# EAGLE board Proiect (EAGLE 9.7.0)
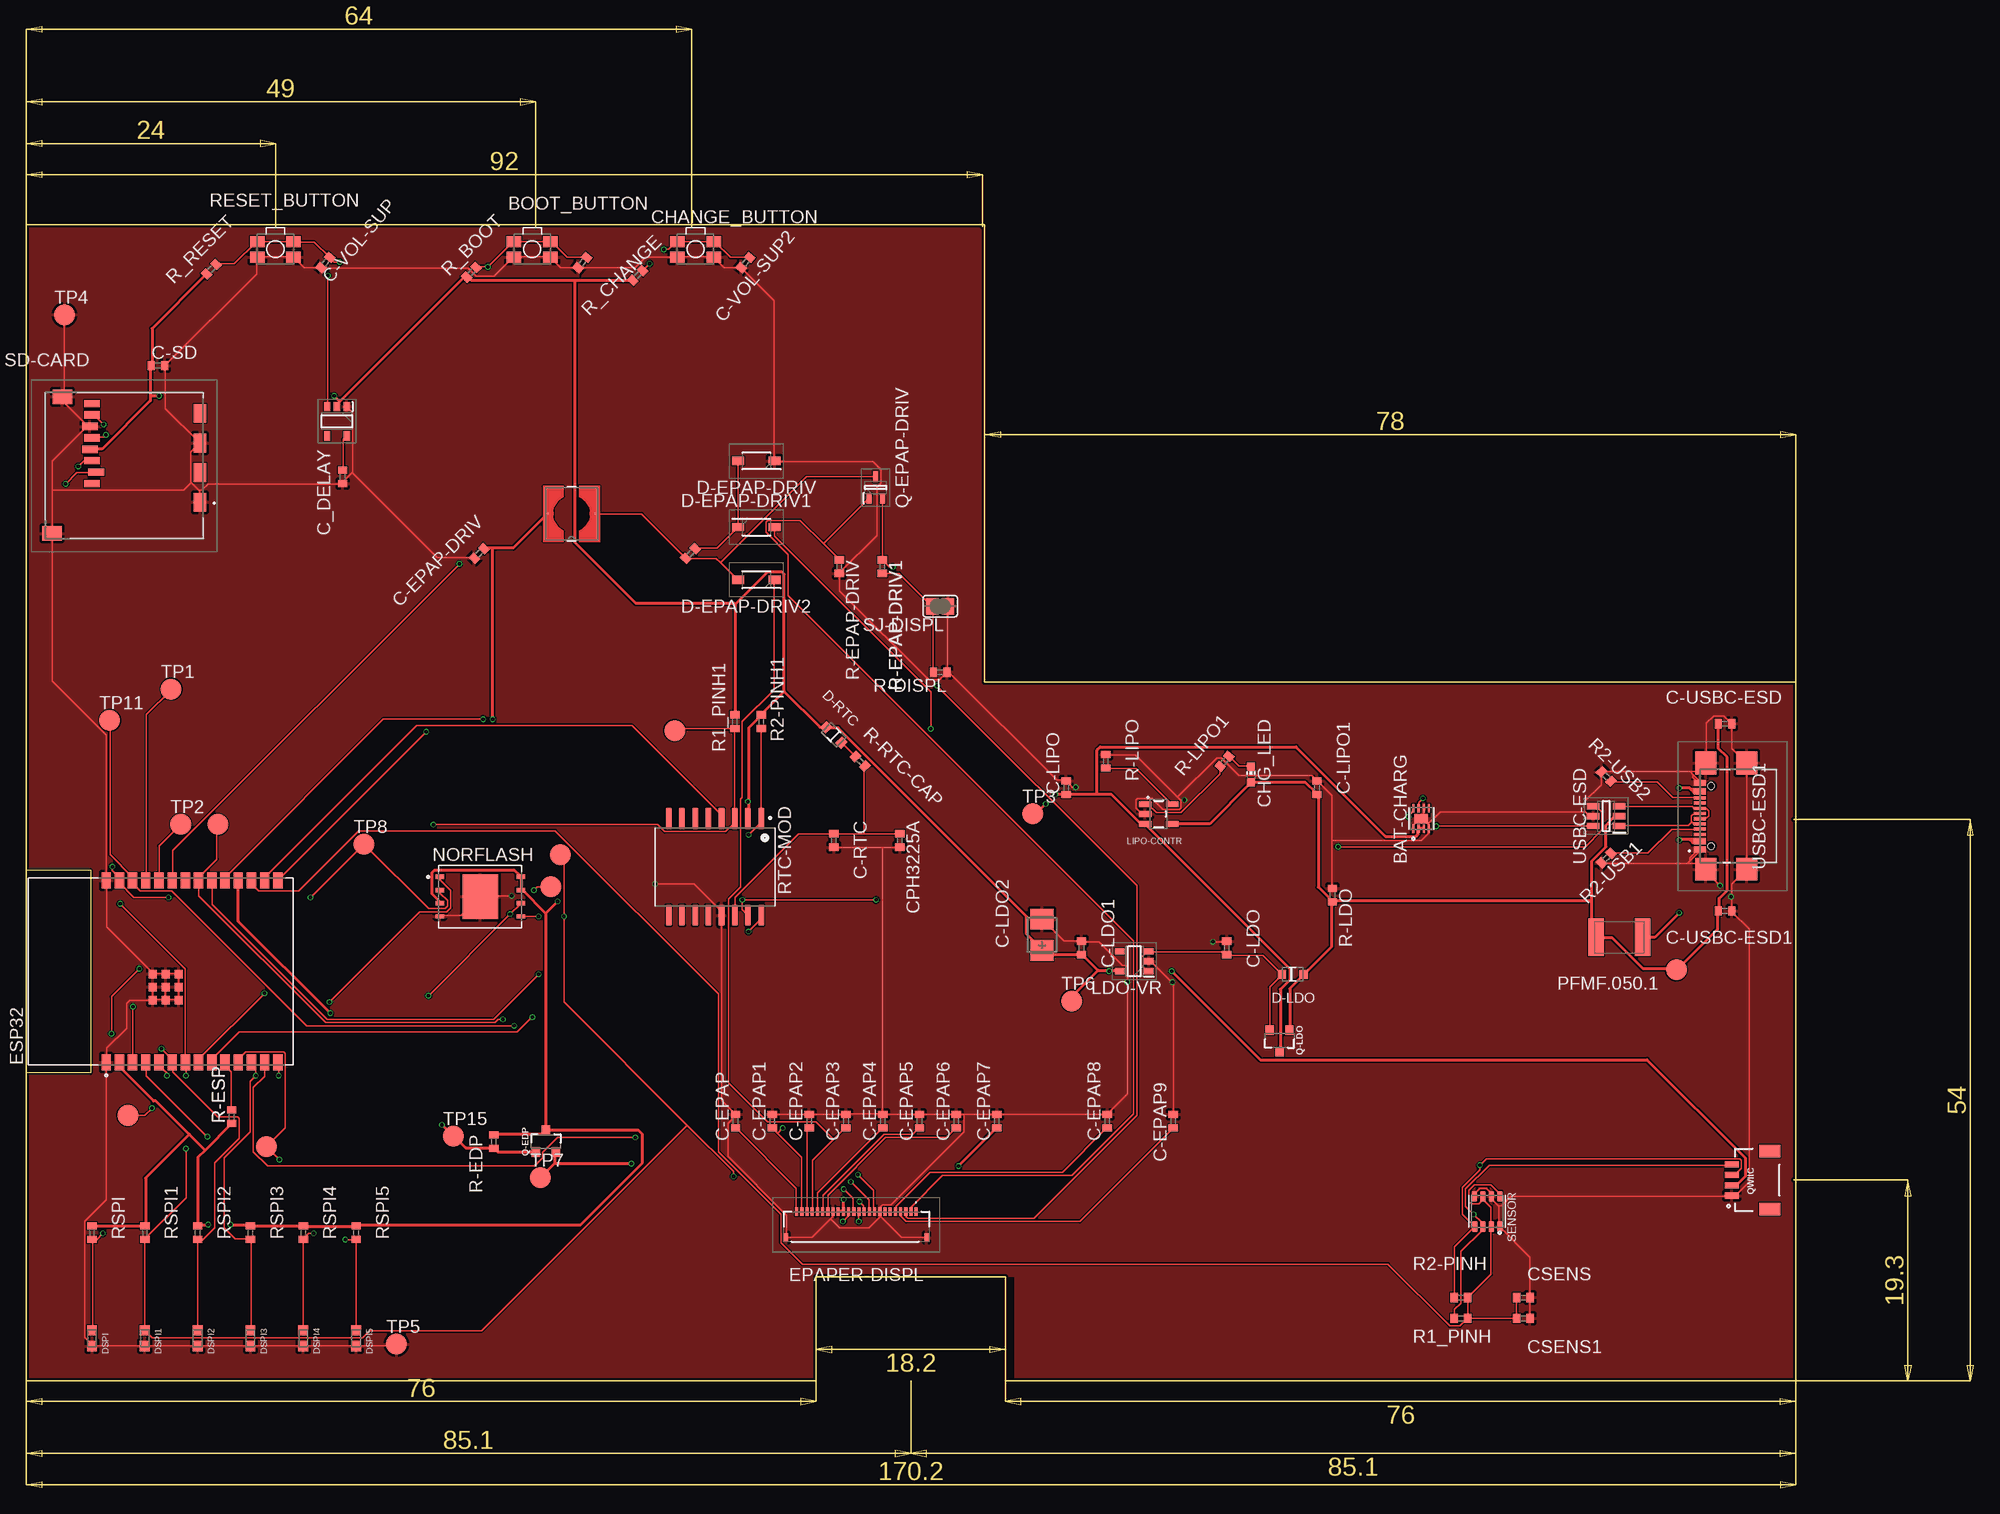
[diagram p1: board, top side]
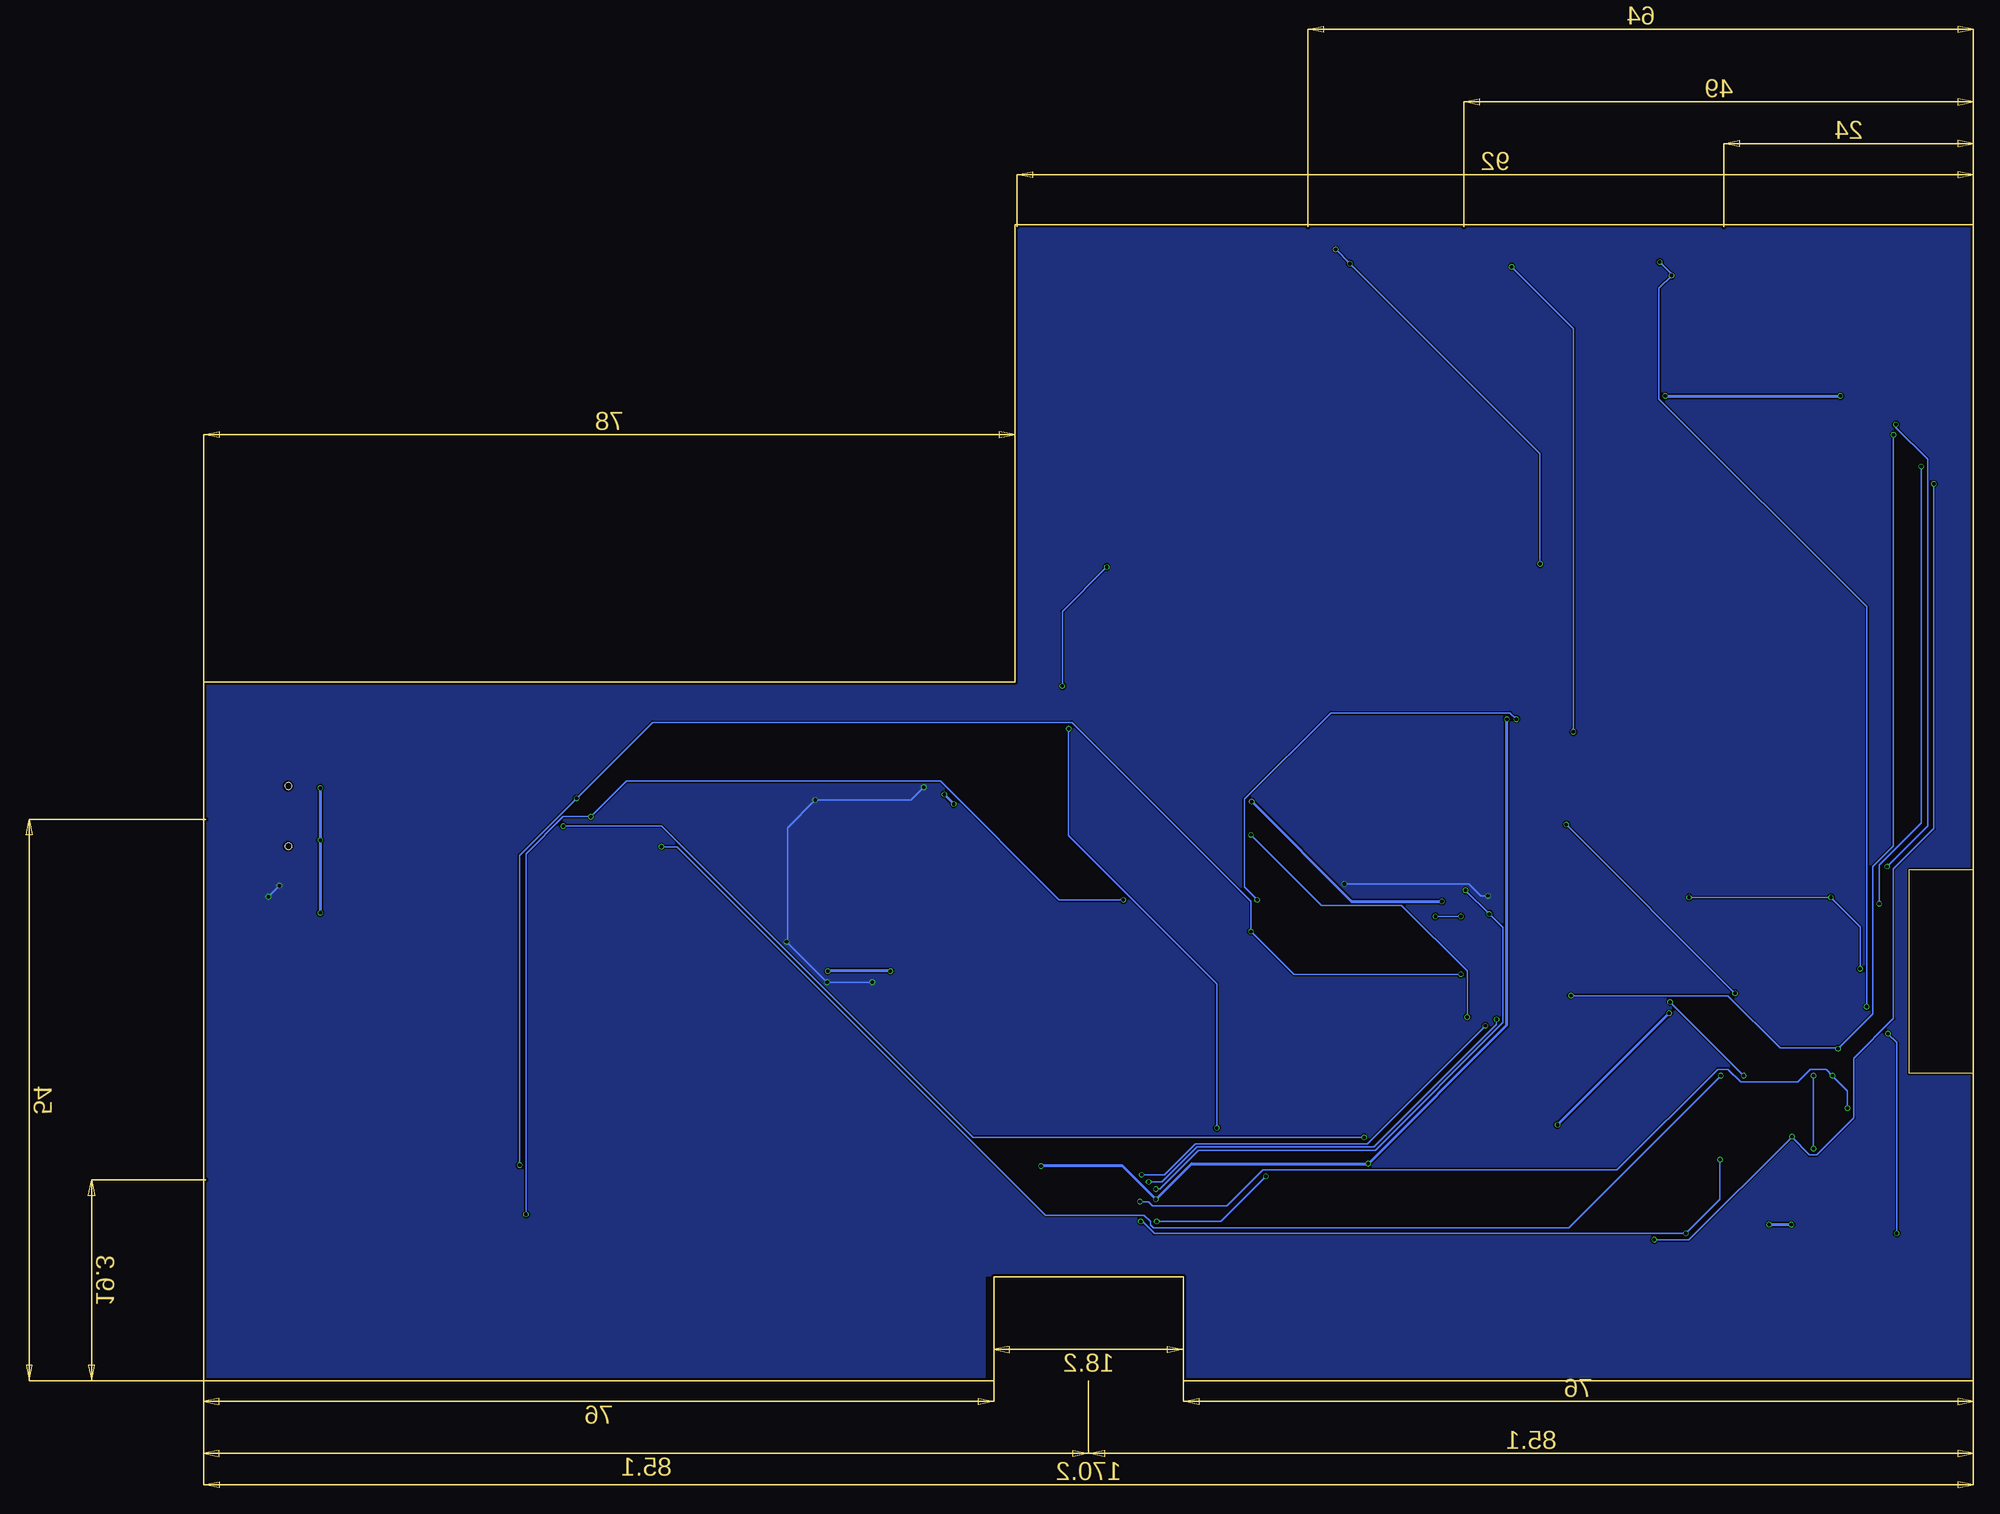
[diagram p2: board, bottom side, seen from below]

Size 170.2 x 111.2 mm. Coordinates in mm from the lower left corner, seen from the top.
Outline: 0,0 76,0 76,10 94.2,10 94.2,0 170.2,0 170.2,67.2 92.2,67.2 92.2,111.2 0,111.2 0,49.12 6.22,49.12 6.22,49.11 6.22,29.59 0,29.59 0,0
Copper layers (1*16): Top 0.035mm / dielectric 1.6mm / Bottom 0.035mm
Design rules "jlcpcb-2layers": minimum track width 5mil, minimum drill 0.3mm, track to track 5mil, track to pad 5mil, pad to pad 5mil, via to via 5mil, smd to smd 5mil, copper to edge 0.2mm, drill to drill 6mil, minimum pad ring 10mil, minimum via ring 3mil, stop-mask expansion 4mil, vias tented up to drill 0mil, thermal gap 10mil
Net classes: 2 POWER: width 0.3 mm

## Footprints (pad centres in the part's own frame; a part is rotated, then mirrored left to right if it is on the bottom)
SON50P200X200X80-9N = smd 0.76 x 0.27: 1 -0.985,0.75; 2 -0.985,0.25; 3 -0.985,-0.25; 4 -0.985,-0.75; 5 0.985,-0.75; 6 0.985,-0.25; 7 0.985,0.25; 8 0.985,0.75 | smd 0.9 x 1.3: 9 0,0
MYBUTTON = smd 1.4 x 1.05: 1 1.75,0.75; 2 -1.75,0.75; 3 -1.75,-0.75; 4 1.75,-0.75
ESP32_WROVER_EAGLE-LTSPICE_C0402 = smd 0.7 x 0.9: 1 -0.65,0; 2 0.65,0
RCL_CT3528 = smd 2 x 2.2: + -1.5,0; - 1.5,0
ADAFRUIT_CHIP-LED0603 = smd 0.8 x 0.8: A 0,-0.75; C 0,0.75
SOD3716X135N = smd 1.15 x 0.8: 1 -1.75,0; 2 1.75,0
ESP32_WROVER_AVX---SD0805S020S1R0_AVX_SD0805S020S1R0_0 = smd 0.8 x 0.9: 1 -1.05,0; 2 1.05,0
DIOC1608X36N = smd 0.97 x 0.94: 1 -0.75,0; 2 0.75,0
FH34SRJ24S05SH99 = smd 0.3 x 0.8: 1 5.75,1.45; 2 5.25,1.45; 3 4.75,1.45; 4 4.25,1.45; 5 3.75,1.45; 6 3.25,1.45; 7 2.75,1.45; 8 2.25,1.45; 9 1.75,1.45; 10 1.25,1.45; 11 0.75,1.45; 12 0.25,1.45; 13 -0.25,1.45; 14 -0.75,1.45; 15 -1.25,1.45; 16 -1.75,1.45; 17 -2.25,1.45; 18 -2.75,1.45; 19 -3.25,1.45; 20 -3.75,1.45; 21 -4.25,1.45; 22 -4.75,1.45; 23 -5.25,1.45; 24 -5.75,1.45 | smd 0.4 x 0.8: MP1 6.75,-1.05; MP2 -6.75,-1.05
XCVR_ESP32-C6-WROOM-1-N8 = smd 1.5 x 0.9: 1 -8.75,5.26; 2 -8.75,3.99; 3 -8.75,2.72; 4 -8.75,1.45; 5 -8.75,0.18; 6 -8.75,-1.09; 7 -8.75,-2.36; 8 -8.75,-3.63; 9 -8.75,-4.9; 10 -8.75,-6.17; 11 -8.75,-7.44; 12 -8.75,-8.71; 13 -8.75,-9.98; 14 -8.75,-11.25; 15 8.75,-11.25; 16 8.75,-9.98; 17 8.75,-8.71; 18 8.75,-7.44; 19 8.75,-6.17; 20 8.75,-4.9; 21 8.75,-3.63; 22 8.75,-2.36; 23 8.75,-1.09; 24 8.75,0.18; 25 8.75,1.45; 26 8.75,2.72; 27 8.75,3.99; 28 8.75,5.26 | smd 0.8 x 0.8: 29_1 -2.755,0.79; 29_2 -1.505,0.79; 29_3 -0.255,0.79; 29_4 -2.755,-0.46; 29_5 -1.505,-0.46; 29_6 -0.255,-0.46; 29_7 -2.755,-1.71; 29_8 -1.505,-1.71; 29_9 -0.255,-1.71
IND_4828-WE-TPC_WRE = smd 0.127 x 0.127: 1 -2.286,0; 2 2.286,0
SOT95P280X120-5N = smd 0.9 x 0.6: 1 -1.4,0.95; 2 -1.4,0; 3 -1.4,-0.95; 4 1.4,-0.95; 5 1.4,0.95
ESP32_WROVER_SPARKFUN-IC-POWER_SOT23-5 = smd 0.55 x 1.2: 1 -0.95,-1.3; 2 0,-1.3; 3 0.95,-1.3; 4 0.95,1.3; 5 -0.95,1.3
SON127P600X800X80-9N = smd 0.94 x 0.44: 1 -3.895,1.905; 2 -3.895,0.635; 3 -3.895,-0.635; 4 -3.895,-1.905; 5 3.895,-1.905; 6 3.895,-0.635; 7 3.895,0.635; 8 3.895,1.905 | smd 3.4 x 4.3: 9 0,0
ESP32C6_VARISTOR_CT/CN1812 = smd 1.5 x 3.6: 1 -2.25,0; 2 2.25,0
ESP32_WROVER_SPARKFUN-DISCRETESEMI_SOT23-3 = smd 0.8 x 0.9: 1 -0.95,-1; 2 0.95,-1; 3 0,1.1
SOT65P210X110-3N = smd 1.05 x 0.5: 1 -1.05,0.65; 2 -1.05,-0.65; 3 1.05,0
JST04_1MM_RA = smd 0.6 x 1.35: 1 -1.5,0; 2 -0.5,0; 3 0.5,0; 4 1.5,0 | smd 1.2 x 2: NC1 2.8,-3.675; NC2 -2.8,-3.675
ESP32_WROVER_EAGLE-LTSPICE_R0402 = smd 0.7 x 0.9: 1 -0.65,0; 2 0.65,0
SOIC127P1032X265-16N = smd 2.05 x 0.59: 1 -4.655,4.445; 2 -4.655,3.175; 3 -4.655,1.905; 4 -4.655,0.635; 5 -4.655,-0.635; 6 -4.655,-1.905; 7 -4.655,-3.175; 8 -4.655,-4.445; 9 4.655,-4.445; 10 4.655,-3.175; 11 4.655,-1.905; 12 4.655,-0.635; 13 4.655,0.635; 14 4.655,1.905; 15 4.655,3.175; 16 4.655,4.445
112ATAARR03ATTEND = smd 1.8 x 1.2: G1 10.6,10.4; G2 4.9,10.4; S1 7.75,10.4; S2 2.05,10.4 | smd 1.4 x 1.9: G3 13.6,-3.85; G4 0.45,-2.85 | smd 0.7 x 1.5: P1 8.8,0; P2 7.7,0.4; P3 6.6,0; P4 5.5,-0.2; P5 4.4,0; P6 3.3,-0.2; P7 2.2,0; P8 1.1,0
ESP32_WROVER_BME680_PSON80P300X300X100-8N = smd 1.016 x 0.5: 1 1.458,1.2; 2 1.458,0.4; 3 1.458,-0.4; 4 1.458,-1.2; 5 -1.458,-1.22; 6 -1.458,-0.4; 7 -1.458,0.4; 8 -1.458,1.2
SJ = smd 1.168 x 1.6: 1 -0.762,0; 2 0.762,0
TP20R = smd 2 x 2: TP 0,0
SOT95P280X145-6N = smd 1.2 x 0.6: 1 -1.25,0.95; 2 -1.25,0; 3 -1.25,-0.95; 4 1.25,-0.95; 5 1.25,0; 6 1.25,0.95
SAMACSYS_PARTS_USB4110GFA = smd 0.3 x 1.15: A1 -3.35,3.678; A4 -2.55,3.678; A5 -1.25,3.678; A6 -0.25,3.678; A7 0.25,3.678; A8 1.25,3.678; A9 2.55,3.678; A12 3.35,3.678; B1 3.05,3.678; B4 2.25,3.678; B5 1.75,3.678; B6 0.75,3.678; B7 -0.75,3.678; B8 -1.75,3.678; B9 -2.25,3.678; B12 -3.05,3.678 | smd 2.18 x 2: MP1 -5.11,-0.827; MP2 5.11,-0.827; MP3 -5.11,3.103; MP4 5.11,3.103 | hole 0.65: -2.89,2.603; 2.89,2.603
SOT95P280X125-5N = smd 0.9 x 0.6: 1 -1.4,0.95; 2 -1.4,0; 3 -1.4,-0.95; 4 1.4,-0.95; 5 1.4,0.95

## Placement (x,y rotation side)
BAT-CHARG  MAX17048G+T10  [SON50P200X200X80-9N]  134.19,54.07 90 top
BOOT_BUTTON  BOOT_BUTTON  [MYBUTTON]  48.69,108.82 180 top
C-EPAP  1uF/50V  [ESP32_WROVER_EAGLE-LTSPICE_C0402]  68.24,24.97 90 top
C-EPAP1  1uF/50V  [ESP32_WROVER_EAGLE-LTSPICE_C0402]  71.78,24.97 90 top
C-EPAP2  1uF/50V  [ESP32_WROVER_EAGLE-LTSPICE_C0402]  75.32,24.97 90 top
C-EPAP3  1uF/50V  [ESP32_WROVER_EAGLE-LTSPICE_C0402]  78.86,24.97 90 top
C-EPAP4  1uF/50V  [ESP32_WROVER_EAGLE-LTSPICE_C0402]  82.4,24.97 90 top
C-EPAP5  1uF/50V  [ESP32_WROVER_EAGLE-LTSPICE_C0402]  85.94,24.97 90 top
C-EPAP6  1uF/50V  [ESP32_WROVER_EAGLE-LTSPICE_C0402]  89.48,24.97 90 top
C-EPAP7  0.1uF/50V  [ESP32_WROVER_EAGLE-LTSPICE_C0402]  93.37,24.97 90 top
C-EPAP8  1uF/50V  [ESP32_WROVER_EAGLE-LTSPICE_C0402]  103.99,24.97 90 top
C-EPAP9  1uF/50V  [ESP32_WROVER_EAGLE-LTSPICE_C0402]  110.34,24.97 90 top
C-EPAP-DRIV  10uF  [ESP32_WROVER_EAGLE-LTSPICE_C0402]  43.58,79.57 225 top
C-EPAP-DRIV1  4.7uF/25V  [ESP32_WROVER_EAGLE-LTSPICE_C0402]  63.9,79.57 225 top
C-LDO  4.7uF  [ESP32_WROVER_EAGLE-LTSPICE_C0402]  115.48,41.62 90 top
C-LDO1  4.7uF  [ESP32_WROVER_EAGLE-LTSPICE_C0402]  101.51,41.62 90 top
C-LDO2  100uF  [RCL_CT3528]  97.7,42.89 90 top
C-LIPO  4.7uF  [ESP32_WROVER_EAGLE-LTSPICE_C0402]  100.03,57.04 90 top
C-LIPO1  4.7uF  [ESP32_WROVER_EAGLE-LTSPICE_C0402]  124.16,57.04 90 top
C-RTC  100nF  [ESP32_WROVER_EAGLE-LTSPICE_C0402]  77.69,51.96 270 top
C-SD  100nF  [ESP32_WROVER_EAGLE-LTSPICE_C0402]  12.7,97.63 0 top
C-USBC-ESD  100nF  [ESP32_WROVER_EAGLE-LTSPICE_C0402]  163.4,63.19 0 top
C-USBC-ESD1  4.7uF  [ESP32_WROVER_EAGLE-LTSPICE_C0402]  163.4,45.18 0 top
C-VOL-SUP  1uF  [ESP32_WROVER_EAGLE-LTSPICE_C0402]  28.8,107.55 230 top
C-VOL-SUP1  100nF  [ESP32_WROVER_EAGLE-LTSPICE_C0402]  53.5,107.55 230 top
C-VOL-SUP2  100nF  [ESP32_WROVER_EAGLE-LTSPICE_C0402]  69.2,107.55 230 top
C_DELAY  100nF  [ESP32_WROVER_EAGLE-LTSPICE_C0402]  30.45,86.94 270 top
CHANGE_BUTTON  CHANGE_BUTTON  [MYBUTTON]  64.39,108.82 180 top
CHG_LED  [ADAFRUIT_CHIP-LED0603]  117.81,58.31 0 top
CPH3225A  C10_SUPERCAP  [ESP32_WROVER_EAGLE-LTSPICE_C0402]  84.04,51.96 270 top
CSENS  100nF  [ESP32_WROVER_EAGLE-LTSPICE_C0402]  144,8 0 top
CSENS1  100nF  [ESP32_WROVER_EAGLE-LTSPICE_C0402]  144,6 0 top
D-EPAP-DRIV  MBR0530  [SOD3716X135N]  70.25,88.46 180 top
D-EPAP-DRIV1  MBR0530  [SOD3716X135N]  70.25,82.11 0 top
D-EPAP-DRIV2  MBR0530  [SOD3716X135N]  70.25,77.03 180 top
D-LDO  ESP32_WROVER_AVX---SD0805S020S1R0_AVX_SD0805S020S1R0_0_0AVX_SD0805S020S1R0_0_0  [ESP32_WROVER_AVX---SD0805S020S1R0_AVX_SD0805S020S1R0_0]  121.83,39.08 0 top
D-RTC  ESP32_WROVER_AVX---SD0805S020S1R0_AVX_SD0805S020S1R0_0_0AVX_SD0805S020S1R0_0_0  [ESP32_WROVER_AVX---SD0805S020S1R0_AVX_SD0805S020S1R0_0]  77.69,62.12 135 top
DSPI  PGB1010603MR  [DIOC1608X36N]  6.35,4.08 90 top
DSPI1  PGB1010603MR  [DIOC1608X36N]  11.43,4.08 90 top
DSPI2  PGB1010603MR  [DIOC1608X36N]  16.51,4.08 90 top
DSPI3  PGB1010603MR  [DIOC1608X36N]  21.59,4.08 90 top
DSPI4  PGB1010603MR  [DIOC1608X36N]  26.67,4.08 90 top
DSPI5  PGB1010603MR  [DIOC1608X36N]  31.75,4.08 90 top
EPAPER-DISPL  FH34SRJ-24S-0.5SH_99_  [FH34SRJ24S05SH99]  79.86,14.81 0 top
ESP32  ESP32-C6-WROOM-1-N8  [XCVR_ESP32-C6-WROOM-1-N8]  12.97,39.37 90 top
L2  68uH  [IND_4828-WE-TPC_WRE]  52.47,83.38 180 top
LDO-VR  XC6220A331MR-G  [SOT95P280X120-5N]  106.59,40.35 180 top
LIPO-CONTR  ESP32_WROVER_SPARKFUN-IC-POWER_MCP73831  [ESP32_WROVER_SPARKFUN-IC-POWER_SOT23-5]  108.92,54.5 270 top
NORFLASH  W25Q512JVEIQ  [SON127P600X800X80-9N]  43.69,46.56 0 top
PFMF.050.1  ESP32C6_VARISTORCN1812  [ESP32C6_VARISTOR_CT/CN1812]  153.24,42.64 180 top
Q-EDP  20V/4.2A/52mΩ/1.4W  [ESP32_WROVER_SPARKFUN-DISCRETESEMI_SOT23-3]  50,23 0 top
Q-EPAP-DRIV  SI1308EDL-T1-GE3  [SOT65P210X110-3N]  81.71,85.92 90 top
Q-LDO  20V/4.2A/52mΩ/1.4W  [ESP32_WROVER_SPARKFUN-DISCRETESEMI_SOT23-3]  120.56,32.73 180 top
QWIIC  QWIIC_RIGHT_ANGLE  [JST04_1MM_RA]  164.04,19.3 90 top
R1_PINH  10K  [ESP32_WROVER_EAGLE-LTSPICE_R0402]  138,6 0 top
R1_PINH1  10K  [ESP32_WROVER_EAGLE-LTSPICE_R0402]  68.17,63.39 90 top
R2-PINH  10K  [ESP32_WROVER_EAGLE-LTSPICE_R0402]  138,8 0 top
R2-PINH1  10K  [ESP32_WROVER_EAGLE-LTSPICE_R0402]  70.7,63.39 90 top
R2-USB1  5k1  [ESP32_WROVER_EAGLE-LTSPICE_R0402]  151.97,50.26 45 top
R2-USB2  5k1  [ESP32_WROVER_EAGLE-LTSPICE_R0402]  151.97,58.11 135 top
R-DISPL  2.2  [ESP32_WROVER_EAGLE-LTSPICE_R0402]  87.92,68.14 180 top
R-EDP  10K  [ESP32_WROVER_EAGLE-LTSPICE_R0402]  45,23 270 top
R-EPAP-DRIV  10K  [ESP32_WROVER_EAGLE-LTSPICE_R0402]  78.22,78.3 270 top
R-EPAP-DRIV1  0.47  [ESP32_WROVER_EAGLE-LTSPICE_R0402]  82.36,78.3 270 top
R-ESP  2K  [ESP32_WROVER_EAGLE-LTSPICE_R0402]  19.78,25.4 90 top
R-LDO  100K  [ESP32_WROVER_EAGLE-LTSPICE_R0402]  125.64,46.7 270 top
R-LIPO  2K  [ESP32_WROVER_EAGLE-LTSPICE_R0402]  103.84,59.58 90 top
R-LIPO1  200  [ESP32_WROVER_EAGLE-LTSPICE_R0402]  115.27,59.58 50 top
R-RTC-CAP  15  [ESP32_WROVER_EAGLE-LTSPICE_R0402]  80.23,59.58 135 top
R_BOOT  10K  [ESP32_WROVER_EAGLE-LTSPICE_R0402]  42.83,106.61 45 top
R_CHANGE  10K  [ESP32_WROVER_EAGLE-LTSPICE_R0402]  58.83,106.31 45 top
R_RESET  10K  [ESP32_WROVER_EAGLE-LTSPICE_R0402]  17.83,106.91 45 top
RESET_BUTTON  RESET_BUTTON  [MYBUTTON]  23.99,108.82 180 top
RSPI  10K  [ESP32_WROVER_EAGLE-LTSPICE_R0402]  6.35,14.24 90 top
RSPI1  10K  [ESP32_WROVER_EAGLE-LTSPICE_R0402]  11.43,14.24 90 top
RSPI2  10K  [ESP32_WROVER_EAGLE-LTSPICE_R0402]  16.51,14.24 90 top
RSPI3  10K  [ESP32_WROVER_EAGLE-LTSPICE_R0402]  21.59,14.24 90 top
RSPI4  10K  [ESP32_WROVER_EAGLE-LTSPICE_R0402]  26.67,14.24 90 top
RSPI5  10K  [ESP32_WROVER_EAGLE-LTSPICE_R0402]  31.75,14.24 90 top
RTC-MOD  DS3231SN#  [SOIC127P1032X265-16N]  66.26,49.42 270 top
SD-CARD  112A-TAAR-R03_ATTEND  [112ATAARR03ATTEND]  6.35,95.09 270 top
SENSOR  BME688  [ESP32_WROVER_BME680_PSON80P300X300X100-8N]  140.53,16.28 270 top
SJ-DISPL  [SJ]  87.92,74.49 180 top
TP1  TPTP20R  [TP20R]  13.96,66.52 0 top
TP2  TPTP20R  [TP20R]  14.88,53.52 0 top
TP3  TPTP20R  [TP20R]  96.8,54.52 0 top
TP4  TPTP20R  [TP20R]  3.72,102.52 0 top
TP5  TPTP20R  [TP20R]  35.64,3.52 0 top
TP6  TPTP20R  [TP20R]  100.56,36.52 0 top
TP7  TPTP20R  [TP20R]  49.48,19.52 0 top
TP8  TPTP20R  [TP20R]  32.49,51.6 0 top
TP9  TPTP20R  [TP20R]  51.41,50.6 0 top
TP10  TPTP20R  [TP20R]  50.49,47.52 0 top
TP11  TPTP20R  [TP20R]  8.04,63.52 0 top
TP12  TPTP20R  [TP20R]  23.14,22.52 0 top
TP13  TPTP20R  [TP20R]  9.79,25.52 0 top
TP14  TPTP20R  [TP20R]  18.44,53.52 0 top
TP15  TPTP20R  [TP20R]  41.09,23.52 0 top
TP16  TPTP20R  [TP20R]  158.74,39.52 0 top
TP17  TPTP20R  [TP20R]  62.39,62.52 0 top
USBC-ESD  USBLC6-2SC6Y  [SOT95P280X145-6N]  151.97,54.3 180 top
USBC-ESD1  SAMACSYS_PARTS_USB4110-GF-A  [SAMACSYS_PARTS_USB4110GFA]  164.67,54.3 90 top
VOL-SUPER  VOL-SUPER-RES  [SOT95P280X125-5N]  29.91,92.29 270 top

## Tracks (layer width: path | path; a pad name or v marks a point on that pad's centre or on a via)
3V3  (via drill 0.35)
  Top 0.3: R-EDP.1 45.03,23.7 49.61,23.7 49.99,24.08 Q-EDP.3 | NORFLASH.3 39.78,45.95 39.78,46.1 39.01,46.86 39.01,48.84 39.24,49.07 47.02,49.07 47.55,48.54 NORFLASH.8 47.62,48.39 47.62,47.24 NORFLASH.7 47.7,47.24 49.99,44.96 | 49.99,44.96 49.99,24.23 Q-EDP.3 | RSPI.2 6.4,14.86 11.43,14.86 RSPI1.2 11.51,15.01 11.51,19.51 15.7,23.7 | 17.22,22.17 19.74,24.69 R-ESP.1 | 17.22,22.17 16.54,21.49 16.54,14.94 RSPI2.2 16.61,15.01 v17.53,15.01 | 17.22,22.17 15.7,23.7 | 15.7,23.7 12.5,26.9 12.27,26.9 8.99,30.18 8.99,30.56 ESP32.2 | v19.66,15.01 21.49,15.01 RSPI3.2 21.64,14.86 26.67,14.86 RSPI4.2 26.75,14.86 31.7,14.86 RSPI5.2 31.85,15.01 53.34,15.01 59.28,20.95 59.28,23.7 58.9,24.08 50.14,24.08 Q-EDP.3 | R_RESET.1 17.3,106.38 12.12,101.19 12.12,97.69 C-SD.1 11.96,97.54 11.96,94.72 | 11.96,94.72 11.96,94.26 7.32,89.61 6.17,89.61 SD-CARD.P4 | 30.18,94.18 42.14,106.15 R_BOOT.1 42.52,106.15 42.82,105.84 52.81,105.84 | 30.18,94.18 29.95,93.95 29.95,93.73 VOL-SUPER.2 | 52.81,105.84 R_CHANGE.1 | v12.8,94.72 11.96,94.72 | 30.18,94.18 v29.64,94.72 | 68.2,74.68 68.2,64.08 R1_PINH1.2 | 68.2,74.68 71.32,77.8 72.69,77.8 72.92,77.57 72.92,66.29 | 72.92,66.29 70.71,64.08 R2-PINH1.2 70.64,63.93 69.49,62.79 69.49,55.7 | 72.92,66.29 76.35,62.87 76.89,62.87 D-RTC.2 77.04,62.79 78.11,62.79 96.24,44.65 96.24,42.98 97.69,41.53 C-LDO2.+ 97.77,41.38 98.15,41 101.5,41 C-LDO1.1 101.65,40.92 103.1,39.47 | 69.49,55.7 69.49,54.1 RTC-MOD.2 | 103.1,39.47 104.17,39.47 | 104.17,39.47 105.16,39.47 LDO-VR.5 | v110.19,39.4 118.72,30.86 155.91,30.86 165.35,21.41 165.35,19.66 164.52,18.82 164.06,18.82 QWIIC.2
  Top 0.3: v104.17,39.4 104.17,39.47 | 103.1,39.47 100.58,36.96 100.58,36.58 TP6.TP | 52.81,105.84 52.81,80.62 58.67,74.75 68.12,74.75 68.2,74.68 | v51.13,46.1 49.99,44.96 | v69.42,55.7 69.49,55.7
  Bottom 0.3: v17.53,15.01 v19.66,15.01 | v29.64,94.72 v12.8,94.72 | v104.17,39.4 v110.19,39.4 | v51.13,46.1 59.82,46.1 v69.42,55.7
32KHZ  (via drill 0.35)
  Top 0.152: R2-PINH1.1 70.71,62.71 70.71,54.1 RTC-MOD.1 70.64,54.03 70.64,53.65 v69.49,52.5 | v48.69,34.98 47.24,33.53 20.5,33.53 17.91,30.94 17.91,30.63 ESP32.9
  Bottom 0.152: v48.69,34.98 48.69,39.4 55.02,45.72 62.71,45.72 v69.49,52.5
DN
  Top 0.152: 160.21,53.76 160.17,53.8 160.17,54.33 160.32,54.48 160.93,54.48 USBC-ESD1.A7 | 160.21,53.76 160.4,53.57 160.93,53.57 USBC-ESD1.B7 | 160.21,53.76 159.87,53.42 153.24,53.42 USBC-ESD.1
DP
  Top 0.152: USBC-ESD1.A6 161.01,54.1 161.62,54.1 161.85,54.33 161.85,54.79 161.62,55.02 161.01,55.02 USBC-ESD1.B6 160.93,55.09 160.4,55.09 160.25,55.24 153.24,55.24 USBC-ESD.3
EPD_3V3  (via drill 0.35)
  Top 0.3: 44.88,80.09 46.86,80.09 50.14,83.36 L2.2 | 44.88,80.09 44.04,80.09 C-EPAP-DRIV.1 | 50.9,20.95 50.9,21.95 Q-EDP.2 | 50.9,20.95 49.53,19.58 TP7.TP | EPAPER-DISPL.16 78.18,16.31 78.56,16.31 EPAPER-DISPL.15 78.64,16.38 v78.64,17.45 | v89.69,20.65 93.34,24.31 C-EPAP7.1 | v58.22,20.88 50.98,20.88 50.9,20.95 | v44.88,63.63 44.88,80.09
  Bottom 0.3: v89.69,20.65 81.84,20.65 v78.64,17.45 75.21,20.88 v58.22,20.88 44.88,34.21 v44.88,63.63
EPD_3V3_C  (via drill 0.35)
  Top 0.3: Q-EDP.1 49,22.02 45.34,22.02 45.03,22.33 R-EDP.2 44.88,22.4 42.29,22.4 41.22,23.47 TP15.TP 41.07,23.55 v40.01,24.61 | v29.26,35.36 20.42,44.2 20.42,48.08 ESP32.18
  Bottom 0.3: v40.01,24.61 v29.26,35.36
EPD_BUSY  (via drill 0.35)
  Top 0.152: v80.01,19.81 81.53,18.29 81.53,16.31 EPAPER-DISPL.9 | v46.94,34.14 26.98,34.14 14.02,47.09 10.97,47.09 10.29,47.78 10.29,48.08 ESP32.26 10.21,48.16 10.21,48.46 8.08,50.6 8.08,63.48 TP11.TP
  Bottom 0.152: v80.01,19.81 77.8,19.81 74.83,22.78 58.29,22.78 v46.94,34.14
EPD_CS  (via drill 0.35)
  Top 0.152: ESP32.11 20.42,30.63 20.42,30.94 21.11,31.62 24.77,31.62 24.92,31.47 24.92,24.31 23.16,22.55 TP12.TP 23.16,22.48 v24.38,21.26 | v80.09,15.32 80.09,16.23 EPAPER-DISPL.12 | v27.66,14.17 27.2,14.17 26.67,13.64 RSPI4.1 DSPI4.2
  Bottom 0.152: v80.09,15.32 79.93,15.32 78.79,14.17 v27.66,14.17 24.38,17.45 v24.38,21.26
EPD_DC  (via drill 0.35)
  Top 0.152: v80.16,17.22 80.54,16.84 80.54,16.31 EPAPER-DISPL.11 | v13.56,29.34 13.56,29.57 12.8,30.33 12.8,30.56 ESP32.5 | v12.12,26.21 11.43,25.53 9.83,25.53 TP13.TP
  Bottom 0.152: v80.16,17.22 79.32,17.22 78.94,16.84 71.78,16.84 68.35,20.27 34.29,20.27 24.61,29.95 23.62,29.95 22.4,28.73 16.92,28.73 15.7,29.95 14.17,29.95 v13.56,29.34 12.12,27.89 v12.12,26.21
EPD_RST  (via drill 0.35)
  Top 0.152: v79.32,19.13 81.08,17.37 81.08,16.31 EPAPER-DISPL.10 | v45.87,34.75 45.41,34.75 45.11,34.44 28.8,34.44 16.61,46.63 16.61,48.08 ESP32.21 16.61,48.16 16.61,48.39 18.36,50.14 18.36,53.49 TP14.TP
  Bottom 0.152: v79.32,19.13 78.03,19.13 74.68,22.48 57.68,22.48 45.87,34.29 v45.87,34.75
FLASH_CS  (via drill 0.35)
  Top 0.152: DSPI3.2 21.64,4.88 21.64,13.56 RSPI3.1 21.57,13.64 20.12,13.64 19.05,14.71 19.05,21.41 21.57,23.93 21.57,28.8 v22.1,29.34 22.1,30.18 21.72,30.56 ESP32.12 | v29.18,36.42 37.87,45.11 40.46,45.11 40.84,45.49 40.84,47.17 39.85,48.16 39.85,48.46 NORFLASH.1
  Bottom 0.152: v22.1,29.34 v29.18,36.42
GDR
  Top 0.152: 76.69,80.5 78.18,79.02 R-EPAP-DRIV.1 | 76.69,80.5 74.45,82.75 71.32,82.75 71.17,82.6 71.17,81.61 73.3,79.48 73.3,75.51 106.53,42.29 106.53,25.68 100.58,19.74 88.16,19.74 85.11,16.69 85.11,16.31 EPAPER-DISPL.2 | 76.69,80.5 81,84.81 Q-EPAP-DRIV.1
GND  (via drill 0.35)
  Top 0.152: 110.22,38.29 110.34,38.18 110.34,25.68 C-EPAP9.2 | 110.22,38.29 108.2,40.31 108.05,40.31 LDO-VR.2 | v114.15,42.22 115.44,42.22 C-LDO.2 | v110.26,38.33 110.22,38.29 | C-LDO2.- 97.77,44.35 99.82,42.29 101.5,42.29 C-LDO1.2 101.58,42.22 103.17,42.22 105.46,39.93 105.77,39.93 105.92,39.78 v105.92,38.33 105.92,27.58 104.01,25.68 C-EPAP8.2 103.94,25.6 93.42,25.6 C-EPAP7.2 93.34,25.6 90.22,25.6 | C-EPAP1.2 71.78,25.6 75.29,25.6 C-EPAP2.2 75.36,25.6 78.79,25.6 C-EPAP3.2 78.87,25.68 82.3,25.68 C-EPAP4.2 | 82.37,51.28 83.97,51.28 CPH3225A.2 | 82.37,51.28 77.72,51.28 C-RTC.2 | C-EPAP4.2 82.45,25.6 85.88,25.6 C-EPAP5.2 85.95,25.6 89.46,25.6 C-EPAP6.2 89.53,25.6 90.22,25.6 | 82.37,51.28 82.37,25.68 C-EPAP4.2 | NORFLASH.4 39.85,44.73 41.83,44.73 43.66,46.56 NORFLASH.9 43.74,46.63 v46.71,46.63 | 82.18,15.81 84.2,13.79 86.56,13.79 EPAPER-DISPL.MP1 | 82.18,15.81 82.14,15.85 82.14,16.23 EPAPER-DISPL.8 82.14,16.31 82.14,16.69 82.37,16.92 83.21,16.92 90.22,23.93 90.22,25.6 | 77.38,15.58 77.57,15.77 77.57,16.23 EPAPER-DISPL.17 | 77.38,15.58 75.59,13.79 73.15,13.79 EPAPER-DISPL.MP2 73.15,13.87 73.15,15.93 67.51,21.57 67.51,24.77 68.2,25.45 68.2,25.6 C-EPAP.2 68.2,25.68 66.9,26.98 66.9,44.73 RTC-MOD.13 66.83,44.81 66.83,45.19 64.24,47.78 v60.5,47.78 | 82.18,15.81 81.08,14.71 78.26,14.71 77.38,15.58 | CSENS1.2 144.63,6.02 144.63,7.92 CSENS.2 144.63,8 144.63,11.89 141.73,14.78 SENSOR.1 141.66,14.86 141.66,16.76 141.62,16.8 | SENSOR.5 139.37,17.75 139.37,18.06 139.83,18.52 140.44,18.52 140.89,18.06 140.89,17.75 SENSOR.7 140.97,17.68 140.97,17.45 141.62,16.8
  Top 0.152: 141.62,16.8 141.66,16.84 141.88,16.84 142.8,17.75 163.98,17.75 QWIIC.1 164.06,17.83 164.44,17.83 165.74,19.13 165.74,43.43 164.06,45.11 C-USBC-ESD1.2 164.06,46.56 | 159.8,49.76 161.01,49.76 161.54,49.23 USBC-ESD1.MP3 161.62,49.15 161.62,48.92 v162.92,47.62 | 159.8,49.76 151.56,49.76 R2-USB1.1 | 164.06,46.56 164.06,47.78 165.43,49.15 USBC-ESD1.MP1 165.51,49.23 165.51,59.36 USBC-ESD1.MP2 165.43,59.44 164.06,60.81 164.06,63.17 C-USBC-ESD.2 163.98,63.25 163.3,63.93 162.31,63.93 161.62,63.25 161.62,59.44 USBC-ESD1.MP4 161.54,59.36 160.78,58.6 160.04,58.6 | 149.92,54.75 150.34,54.33 150.65,54.33 USBC-ESD.5 | 149.92,54.75 149.88,54.79 149.88,55.7 151.49,57.3 151.49,58.52 R2-USB2.2 151.56,58.6 160.04,58.6 | 164.06,46.56 v163.98,46.56 | 111.06,55.82 111.1,55.78 111.1,55.09 110.95,54.94 109.35,54.94 108.28,56.01 106.91,56.01 106.76,55.85 106.76,55.09 107.29,54.56 107.59,54.56 LIPO-CONTR.2 | 111.06,55.82 110.76,56.12 | 110.76,56.12 106.68,60.2 103.86,60.2 R-LIPO.2 | BAT-CHARG.1 133.5,53.11 133.5,53.49 134.04,54.03 134.19,54.03 BAT-CHARG.9 | 134.84,53.53 134.26,54.1 BAT-CHARG.9 | 134.84,53.53 134.87,53.49 134.87,53.11 BAT-CHARG.4 134.87,53.03 134.87,52.65 134.19,51.97 125.58,51.97 | BAT-CHARG.6 134.42,55.02 134.42,54.33 134.26,54.18 BAT-CHARG.9 | 125.58,51.97 125.58,56.31 124.21,57.68 C-LIPO1.2 124.13,57.76 123.67,58.22 116.66,58.22 114.99,59.89 114.53,59.89 110.76,56.12 | 125.58,51.97 125.58,47.4 R-LDO.1 | 134.84,53.53 136.02,54.71 149.88,54.71 149.92,54.75 | v111.4,55.85 111.1,55.85 111.06,55.82 | ESP32.29_1 12.19,36.65 12.19,37.8 ESP32.29_2
  Top 0.152: ESP32.29_4 13.41,36.65 12.27,36.65 ESP32.29_1 | ESP32.29_5 13.41,37.8 13.41,36.73 ESP32.29_4 | ESP32.29_4 13.49,36.65 14.63,36.65 ESP32.29_7 14.71,36.65 14.71,37.8 ESP32.29_8 14.71,37.87 14.71,39.09 ESP32.29_9 14.63,39.17 13.49,39.17 ESP32.29_6 13.41,39.17 12.19,39.17 ESP32.29_3 12.19,39.24 7.77,43.66 7.77,48.08 ESP32.28 7.7,48.16 7.7,62.1 2.52,67.28 2.52,81.46 SD-CARD.G3 2.52,81.53 2.52,85.65 | ESP32.29_1 12.12,36.58 9.98,36.58 9.68,36.27 9.68,33.91 7.77,32 7.77,30.63 ESP32.1 7.7,30.56 7.7,17.37 5.64,15.32 5.64,4.19 6.4,3.43 DSPI.1 6.4,3.35 11.43,3.35 | TP5.TP 35.59,3.5 35.43,3.35 31.77,3.35 DSPI5.1 31.7,3.35 26.67,3.35 | 26.67,3.35 21.64,3.35 DSPI3.1 21.57,3.35 16.54,3.35 DSPI2.1 16.46,3.35 11.43,3.35 | 11.43,3.35 DSPI1.1 | 26.67,3.35 DSPI4.1 | 2.52,85.65 2.52,88.47 5.87,91.82 SD-CARD.P6 6.1,91.82 5.94,91.82 3.5,94.26 3.5,94.56 SD-CARD.G4 3.5,94.72 3.66,94.87 3.66,102.49 TP4.TP | 31.36,87.36 31.39,87.4 31.39,93.12 30.86,93.65 VOL-SUPER.1 | 31.36,87.36 30.48,86.49 30.48,86.33 C_DELAY.2 30.4,86.26 17.53,86.26 16.92,85.65 16.69,85.65 16.65,85.61 | 31.36,87.36 39.55,79.17 43.05,79.17 C-EPAP-DRIV.2 | 15.89,86.37 15.85,86.41 15.85,89.31 16.69,90.14 SD-CARD.G2 16.69,90.22 13.41,93.5 13.41,97.61 C-SD.2 13.41,97.69 22.17,106.45 22.17,108.05 RESET_BUTTON.1 22.25,108.13 25.68,108.13 RESET_BUTTON.2 25.76,108.05 26.75,107.06 28.35,107.06 C-VOL-SUP.2 28.42,106.98 42.52,106.98 43.28,106.22 45.03,106.22 46.86,108.05 BOOT_BUTTON.1 47.02,108.13 50.37,108.13 BOOT_BUTTON.2 50.44,108.05 51.44,107.06 53.03,107.06 C-VOL-SUP1.2 53.11,107.06 58.6,107.06 59.59,108.05 62.64,108.05 CHANGE_BUTTON.1 62.71,108.13 66.06,108.13 CHANGE_BUTTON.2 66.14,108.05 67.13,107.06 68.73,107.06 C-VOL-SUP2.2 68.81,106.98 71.93,103.86 71.93,88.47 D-EPAP-DRIV.1 72.01,88.39 81.46,88.39 82.22,87.63 82.22,86.33 81.84,85.95 81.84,81.31 78.26,77.72 R-EPAP-DRIV.2 78.26,77.65 78.26,75.97 86.79,67.44 87.86,67.44 88.54,68.12 R-DISPL.1
  Top 0.152: 15.89,86.37 16.65,85.61 | 16.65,85.61 16.69,85.57 16.69,84.51 SD-CARD.G1 | 2.52,85.65 15.16,85.65 15.89,86.37 | R-DISPL.1 88.62,68.2 88.62,74.45 SJ-DISPL.1 | R-DISPL.1 88.7,68.2 99.14,57.76 99.97,57.76 C-LIPO.2 100.05,57.68 100.66,57.07 v100.97,57.07 | USBC-ESD1.A12 160.32,58.32 | 160.32,58.32 160.04,58.6 | USBC-ESD1.B1 160.32,58.02 160.32,58.32 | USBC-ESD1.A1 160.02,49.98 | 160.02,49.98 159.8,49.76 | USBC-ESD1.B12 160.02,50.28 160.02,49.98
  Bottom 0.152: v105.92,38.33 v110.26,38.33 v114.15,42.22 114.07,42.22 114.07,53.19 v111.4,55.85 102.18,55.85 v100.97,57.07 | v46.71,46.63 47.4,46.63 48.54,47.78 v60.5,47.78 | v163.98,46.56 v162.92,47.62
  pour Top: 75.92,10.13 75.97,10.15 95.03,10.15 95.08,10.13 95.13,10.08 95.15,10.03 95.15,0.15 169.85,0.15 169.85,66.85 91.97,66.85 91.92,66.87 91.87,66.92 91.85,66.97 91.85,110.85 0.15,110.85 0.15,0.15 75.85,0.15 75.85,10.03 75.87,10.08
  pour Bottom: 75.92,10.13 75.97,10.15 95.03,10.15 95.08,10.13 95.13,10.08 95.15,10.03 95.15,0.15 169.85,0.15 169.85,66.85 91.97,66.85 91.92,66.87 91.87,66.92 91.85,66.97 91.85,110.85 0.15,110.85 0.15,0.15 75.85,0.15 75.85,10.03 75.87,10.08
GPIO8
  Top 0.152: R-ESP.2 19.74,26.06 19.74,29.72 19.2,30.25 19.2,30.56 ESP32.10
I2C_PW
  Top 0.152: SENSOR.8 141.66,17.75 141.66,18.06 140.89,18.82 139.29,18.82 138.76,18.29 138.76,17.22 138.99,16.99 139.75,16.99 140.13,17.37 SENSOR.6 140.13,17.68 140.13,17.45 140.89,16.69 140.89,14.86 SENSOR.2 140.89,14.78 140.89,10.21 138.68,8 R2-PINH.2 138.68,7.92 138.68,6.02 R1_PINH.2 | CSENS.1 143.33,7.92 143.33,6.02 CSENS1.1 143.26,6.02 138.76,6.02 R1_PINH.2 | ESP32.17 21.72,48.08 21.72,47.78 22.4,47.09 26.21,47.09 32,52.88 50.9,52.88 66.6,37.19 66.6,22.02 72.62,16 72.62,13.26 74.68,11.2 130.99,11.2 136.93,5.26 137.92,5.26 138.61,5.94 R1_PINH.2
INT_RTC  (via drill 0.35)
  Top 0.152: TP17.TP 62.41,62.56 62.56,62.71 68.12,62.71 R1_PINH1.1 68.12,62.64 68.12,54.1 RTC-MOD.3 68.12,54.03 68.12,53.65 67.28,52.81 61.42,52.81 60.73,53.49 v39.17,53.49 | v22.94,37.26 16.61,30.94 16.61,30.63 ESP32.8
  Bottom 0.152: v39.17,53.49 v22.94,37.26
IO/BOOT  (via drill 0.35)
  Top 0.152: C-VOL-SUP1.1 53.87,108.05 52.05,108.05 50.6,109.5 50.44,109.5 BOOT_BUTTON.3 50.37,109.58 47.02,109.58 BOOT_BUTTON.4 46.94,109.5 46.79,109.5 v44.42,107.14 43.36,107.14 R_BOOT.2 | v38.48,62.41 24.23,48.16 ESP32.15
  Bottom 0.152: v38.48,62.41 38.48,101.19 v44.42,107.14
IO/CHANGE  (via drill 0.35)
  Top 0.152: C-VOL-SUP2.1 69.57,108.05 67.74,108.05 66.29,109.5 66.14,109.5 CHANGE_BUTTON.3 66.06,109.58 62.71,109.58 CHANGE_BUTTON.4 62.64,109.5 62.48,109.5 61.8,108.81 v61.34,108.81 | v59.97,107.44 59.36,106.83 R_CHANGE.2 | v41.68,78.56 14.1,50.98 14.1,48.16 ESP32.23
  Bottom 0.152: v61.34,108.81 v59.97,107.44 41.68,89.15 v41.68,78.56
MISO  (via drill 0.35)
  Top 0.152: DSPI.2 6.4,4.88 6.4,13.56 RSPI.1 6.48,13.56 6.78,13.56 v7.39,14.17 | NORFLASH.2 39.85,47.17 39.85,46.86 40.54,46.18 40.54,45.64 40.31,45.41 38.71,45.41 32.54,51.59 TP8.TP 32.46,51.59 v27.36,46.48 | v13.72,46.48 10.36,46.48 8.99,47.85 8.99,48.08 ESP32.27 8.91,48.16 8.91,48.46 8.31,49.07 v8.31,49.45 | v7.47,91.97 6.55,92.89 6.4,92.89 SD-CARD.P7 | v8.23,33.38 8.23,36.96 v10.9,39.62
  Bottom 0.152: v27.36,46.48 v13.72,46.48 10.9,43.66 v10.9,39.62 | v7.47,91.97 7.47,91.67 4.42,88.62 4.42,53.34 v8.31,49.45 | v7.39,14.17 7.39,32.54 v8.23,33.38
MOSI  (via drill 0.35)
  Top 0.152: v78.56,15.32 79.1,15.85 79.1,16.23 EPAPER-DISPL.14 | v68.05,19.66 68.05,20.12 63.59,24.57 | 63.59,24.57 51.74,36.42 v51.74,44.65 51.74,50.29 51.44,50.6 TP9.TP | v49.3,44.65 47.62,44.65 NORFLASH.5 | v15.39,29.34 15.39,30.56 ESP32.7 15.32,30.63 15.32,39.62 v9.07,45.87 | v15.39,22.33 15.39,17.6 11.43,13.64 RSPI1.1 DSPI1.2 11.43,4.8 12.12,4.12 32.38,4.12 33.07,4.8 43.81,4.8 63.59,24.57 | v5.03,87.94 5.56,88.47 6.33,88.47 SD-CARD.P3
  Bottom 0.152: v78.56,15.32 72.39,15.32 v68.05,19.66 | v51.74,44.65 v49.3,44.65 | v15.39,22.33 v15.39,29.34 | v5.03,87.94 5.03,53.65 9.07,49.61 v9.07,45.87
N$1
  Top 0.152: R2-USB1.2 152.48,50.75 156,50.75 158.29,53.03 160.93,53.03 USBC-ESD1.A5
N$2
  Top 0.152: R2-USB2.1 152.48,57.61 156.88,57.61 158.4,56.08 160.93,56.08 USBC-ESD1.B5
N$3
  Top 0.152: EPAPER-DISPL.24 74.07,16.31 74.07,18.52 68.28,24.31 C-EPAP.1
N$4
  Top 0.152: CHG_LED.C 117.81,59.13 116.66,59.13 115.75,60.05 R-LIPO1.2
N$6
  Top 0.152: R-LIPO1.1 114.83,59.05 114.83,58.37 111.1,54.63 108.74,54.63 107.97,55.4 107.67,55.4 LIPO-CONTR.1
N$7
  Top 0.152: R-LIPO.1 103.86,58.9 106.76,58.9 110.19,55.47 LIPO-CONTR.5
N$9
  Top 0.152: EPAPER-DISPL.22 75.13,16.31 75.13,24.16 75.29,24.31 C-EPAP2.1
N$10
  Top 0.152: C-EPAP-DRIV1.1 64.39,80.09 66.45,80.09 68.43,82.07 D-EPAP-DRIV1.1 68.5,82.14 68.5,88.39 D-EPAP-DRIV.2
N$12
  Top 0.152: EPAPER-DISPL.20 76.12,16.31 76.12,18.06 82.37,24.31 C-EPAP4.1
N$13
  Top 0.152: EPAPER-DISPL.19 76.66,16.31 76.66,17.83 82.53,23.7 85.27,23.7 85.88,24.31 C-EPAP5.1
N$14
  Top 0.152: EPAPER-DISPL.18 77.11,16.31 77.11,17.83 82.68,23.39 88.54,23.39 89.46,24.31 C-EPAP6.1
N$15
  Top 0.152: C_DELAY.1 30.48,87.63 30.48,90.53 30.79,90.83 VOL-SUPER.5
N$16
  Top 0.152: EPAPER-DISPL.5 83.67,16.31 83.67,16.76 86.94,20.04 99.67,20.04 103.94,24.31 C-EPAP8.1
N$17
  Top 0.152: EPAPER-DISPL.4 84.12,16.23 84.12,15.85 84.66,15.32 101.35,15.32 110.34,24.31 C-EPAP9.1
N$18
  Top 0.152: LDO-VR.1 107.97,39.47 107.75,39.47 107.29,39.93 107.29,40.77 107.75,41.22 107.97,41.22 LDO-VR.3 108.05,41.22 115.21,41.22 115.44,41 C-LDO.1 115.52,40.92 118.95,40.92 120.78,39.09 D-LDO.1 120.78,39.01 119.63,37.87 119.63,33.76 Q-LDO.2
N$24
  Top 0.152: D-RTC.1 78.49,61.34 79.78,60.05 R-RTC-CAP.2
PREVGH
  Top 0.152: 77.69,23.2 78.79,24.31 C-EPAP3.1 | 77.69,23.2 75.67,21.18 75.67,16.31 EPAPER-DISPL.21 | 77.69,23.2 75.97,24.92 71.32,24.92 67.59,28.65 67.59,46.33 68.73,47.47 68.73,55.93 68.89,56.08 68.89,63.4 71.93,66.45 71.93,76.96 D-EPAP-DRIV2.1
PREVGL  (via drill 0.35)
  Top 0.152: 72.28,23.81 71.78,24.31 C-EPAP1.1 | 72.28,23.81 74.6,21.49 74.6,16.31 EPAPER-DISPL.23 | v87.02,62.71 87.02,66.22 72.01,81.23 72.01,82.07 D-EPAP-DRIV1.2 | 72.28,23.81 v72.77,24.31
  Bottom 0.152: v87.02,62.71 87.02,52.43 72.77,38.18 v72.77,24.31
RESE  (via drill 0.35)
  Top 0.152: v87.63,66.83 106.83,47.62 106.83,25.53 96.93,15.62 84.81,15.62 84.66,15.77 84.66,16.23 EPAPER-DISPL.3 | v83.36,78.26 83.06,78.26 82.37,78.94 R-EPAP-DRIV1.1 82.37,79.02 82.37,84.81 Q-EPAP-DRIV.2
  Bottom 0.152: v87.63,66.83 87.63,73.99 v83.36,78.26
RESE'
  Top 0.152: R-EPAP-DRIV1.2 82.37,77.65 83.97,77.65 87.1,74.52 SJ-DISPL.2 87.17,74.45 87.25,74.37 87.25,68.2 R-DISPL.2
RESET  (via drill 0.35)
  Top 0.152: R_RESET.2 18.36,107.44 20.04,107.44 22.17,109.58 RESET_BUTTON.4 25.68,109.58 RESET_BUTTON.3 25.76,109.5 27.74,109.5 29.18,108.05 C-VOL-SUP.1 29.26,107.97 29.64,107.59 v30.18,107.59 | v29.03,106.3 29.03,93.73 VOL-SUPER.3 | v10.29,35.97 10.29,30.63 ESP32.3
  Bottom 0.152: v30.18,107.59 29.03,106.45 v29.03,106.3 30.25,105.08 30.25,94.41 10.29,74.45 v10.29,35.97
RTC_RST
  Top 0.152: ESP32.16 23.01,48.16 23.01,48.46 37.57,63.02 58.29,63.02 66.83,54.48 66.83,54.1 RTC-MOD.4
RX
  Top 0.152: ESP32.24 12.8,48.16 12.8,51.44 14.86,53.49 TP2.TP
SCK  (via drill 0.35)
  Top 0.152: v78.64,18.44 79.55,17.53 79.55,16.31 EPAPER-DISPL.13 | NORFLASH.6 47.55,45.87 v46.56,44.88 v38.71,37.03 | v48.84,47.17 49.15,47.47 50.44,47.47 TP10.TP | DSPI2.2 16.54,4.88 16.54,13.56 RSPI2.1 16.61,13.56 16.99,13.56 18.14,14.71 18.14,20.95 20.5,23.32 20.5,25.22 20.34,25.38 18.44,25.38 14.1,29.72 14.1,30.56 ESP32.6 14.02,30.63 14.02,30.94 v13.03,31.93 | v7.7,90.98 7.47,90.75 6.4,90.75 SD-CARD.P5
  Bottom 0.152: v78.64,18.44 78.26,18.44 74.52,22.17 57.53,22.17 45.26,34.44 45.26,43.59 v46.56,44.88 v48.84,47.17 | v7.7,90.98 7.7,51.44 9.68,49.45 9.68,35.28 v13.03,31.93 13.03,32 18.59,32 23.62,37.03 v38.71,37.03
SCL  (via drill 0.35)
  Top 0.152: v49.3,39.09 44.96,34.75 28.96,34.75 17.91,45.8 17.91,48.08 ESP32.20 | v69.49,43.2 70.64,44.35 70.64,44.73 RTC-MOD.16 | v134.34,56.01 133.96,55.63 133.96,55.09 BAT-CHARG.7 | R2-PINH.1 137.39,8 137.39,12.88 139.29,14.78 SENSOR.4 139.29,14.86 138.15,16 138.15,18.59 139.83,20.27 v139.83,20.73 140.44,21.34 164.82,21.34 164.97,21.18 164.97,20.42 164.36,19.81 164.06,19.81 QWIIC.3
  Bottom 0.152: v49.3,39.09 65.38,39.09 v69.49,43.2 69.49,46.1 86.72,63.32 127.03,63.32 v134.34,56.01 139.83,50.52 v139.83,20.73
SDA  (via drill 0.35)
  Top 0.152: v43.97,63.63 34.37,63.63 19.2,48.46 19.2,48.16 ESP32.19 | RTC-MOD.15 69.42,44.81 68.89,45.34 v68.89,46.25 v81.76,46.25 | v132.97,54.25 132.97,54.33 133.43,54.79 133.43,55.02 BAT-CHARG.8 | R1_PINH.1 137.39,6.02 137.39,6.86 138,7.47 138,12.42 140.06,14.48 140.06,14.78 SENSOR.3 140.06,14.86 140.06,15.16 v139.22,16 138.46,16.76 138.46,18.44 140.74,20.73 163.98,20.73 QWIIC.4
  Bottom 0.152: v43.97,63.63 44.58,64.24 61.8,64.24 70.1,55.93 70.1,47.47 v68.89,46.25 | v139.22,16 139.22,50.67 135.64,54.25 v132.97,54.25 129.54,57.68 99.36,57.68 87.94,46.25 v81.76,46.25
SRC
  Top 0.152: 66.79,78.68 68.43,77.04 D-EPAP-DRIV2.2 | 66.79,78.68 66.37,79.1 63.48,79.1 C-EPAP-DRIV1.2 63.4,79.17 59.21,83.36 54.79,83.36 L2.1 | 66.79,78.68 75.06,86.94 81.69,86.94 Q-EPAP-DRIV.3
SS_SD  (via drill 0.35)
  Top 0.152: DSPI5.2 31.77,4.88 31.77,13.56 RSPI5.1 31.7,13.56 v30.71,13.56 | v17.45,23.47 11.58,29.34 11.58,30.56 ESP32.4 | v3.81,86.26 4.88,87.33 6.71,87.33 SD-CARD.P2
  Bottom 0.152: v30.71,13.56 27.36,13.56 v17.45,23.47 17.45,23.39 15.77,21.72 15.09,21.72 11.51,25.3 11.51,31.01 7.7,34.82 7.7,49.23 3.81,53.11 v3.81,86.26
TX
  Top 0.152: ESP32.25 11.58,48.16 11.58,64.08 13.95,66.45 TP1.TP
USB_D+  (via drill 0.35)
  Top 0.152: v126.19,51.36 149.96,51.36 151.56,52.96 151.56,54.71 151.03,55.24 USBC-ESD.4 | v24.31,29.34 24.31,30.48 24.23,30.56 ESP32.14
  Bottom 0.152: v126.19,51.36 124.66,51.36 89.23,15.93 79.78,15.93 79.17,15.32 79.17,15.01 78.87,14.71 38.94,14.71 v24.31,29.34
USB_D-  (via drill 0.35)
  Top 0.152: v135.64,53.34 150.65,53.34 USBC-ESD.6 | v58.6,23.39 51.13,23.39 49.68,21.95 49.68,21.41 48.92,20.65 23.24,20.65 21.87,22.02 21.87,28.19 22.94,29.26 22.94,30.56 ESP32.13
  Bottom 0.152: v135.64,53.34 126.19,53.34 96.24,23.39 v58.6,23.39
VBAT  (via drill 0.35)
  Top 0.3: BAT-CHARG.3 134.42,53.11 133.96,53.11 BAT-CHARG.2 133.88,52.96 133.88,52.58 133.66,52.35 130.76,52.35 122.15,60.96 103.33,60.96 103.02,60.66 103.02,56.39 | Q-LDO.3 120.62,31.7 120.62,37.64 121.54,38.56 121.54,39.62 107.67,53.49 LIPO-CONTR.3 107.52,53.65 107.14,53.65 104.39,56.39 103.02,56.39 | 103.02,56.39 100.05,56.39 C-LIPO.1 99.9,56.39 v98.98,56.39 | v98.07,55.47 97.16,54.56 96.85,54.56 TP3.TP
  Bottom 0.3: v98.98,56.39 v98.07,55.47
VBUS
  Top 0.3: 150.57,46.18 150.57,43.05 150.95,42.67 PFMF.050.1.2 151.1,42.6 152.55,42.6 155.52,39.62 158.65,39.62 TP16.TP 158.8,39.55 162.69,43.43 162.69,45.11 C-USBC-ESD1.1 162.84,45.26 162.84,46.41 163.6,47.17 163.6,59.97 162.76,60.81 162.76,63.17 C-USBC-ESD.1 | 150.57,46.18 150.57,49.99 151.94,51.36 151.94,53.42 152.78,54.25 153.16,54.25 USBC-ESD.2 | Q-LDO.1 121.54,33.76 121.54,37.72 122.83,39.01 D-LDO.2 122.99,39.17 125.58,41.76 125.58,46.02 R-LDO.2 | LIPO-CONTR.4 110.26,53.57 113.84,53.57 117.73,57.45 CHG_LED.A 117.88,57.53 123.06,57.53 124.13,56.46 C-LIPO1.1 124.28,56.31 124.28,47.47 125.58,46.18 R-LDO.2 | 150.57,46.18 125.73,46.18 R-LDO.2
VRTC
  Top 0.152: 80.62,52.58 83.97,52.58 CPH3225A.1 | 80.62,52.58 77.72,52.58 C-RTC.1 77.65,52.58 74.3,52.58 68.2,46.48 68.2,44.81 RTC-MOD.14 | 80.62,52.58 80.62,59.05 R-RTC-CAP.1
VUSB  (via drill 0.35)
  Top 0.3: USBC-ESD1.A9 160.15,56.85 | 160.15,56.85 160,57 v159,57 | USBC-ESD1.B4 160.45,56.55 160.15,56.85 | USBC-ESD1.B9 160,52.05 | USBC-ESD1.A4 160.3,51.75 160,52.05 | v159,45 156.64,42.64 PFMF.050.1.1 | 160,52.05 159.05,52.05 v159,52
  Bottom 0.3: v159,57 v159,52 v159,45